# Altium schematic sheet Voltage Measurement Stage.SchDoc: Voltage Measurement Stage
size A3; Date: 28.08.2010; ApprovedBy: V.Gyurov; CheckedBy: V.Gyurov; Author: V.Gyurov; CompanyName: V.Gyurov; DrawnBy: V.Gyurov; Engineer: V.Gyurov; DocumentNumber: 3; Revision: 00; SheetNumber: 3; SheetTotal: 7; VersionControl_RevNumber: V1.00 R.00; CurrentDate: 28.08.2010; DocumentName: Voltage Measurement Stage; ModifiedDate: 28.08.2010
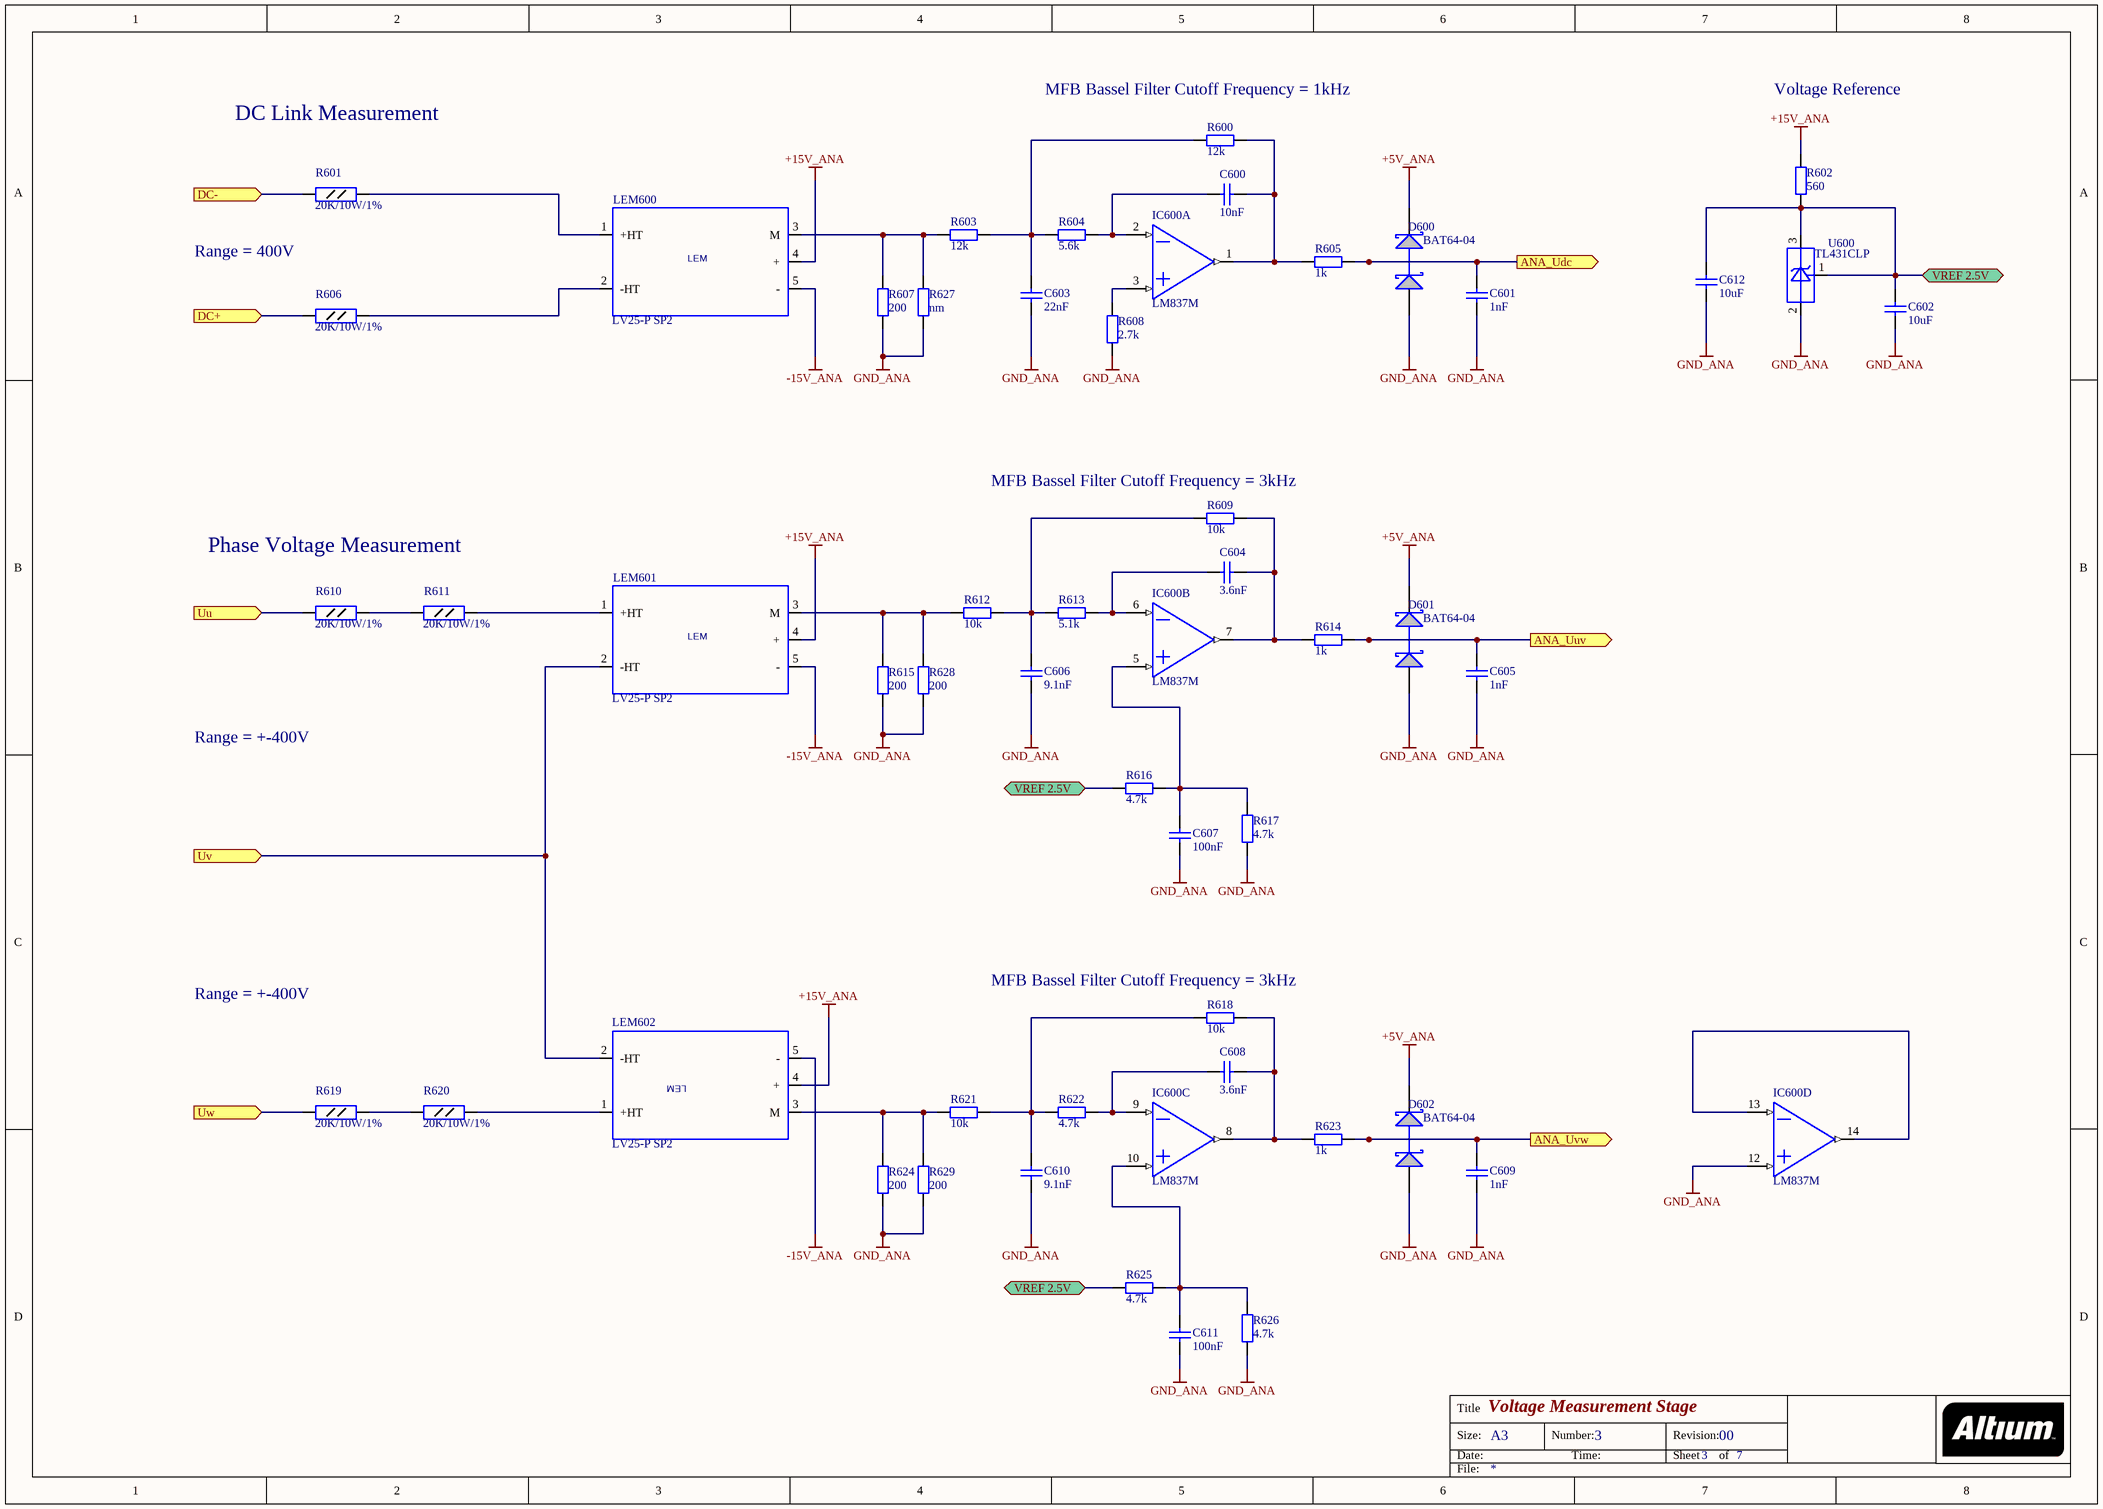
[diagram p0: Voltage Measurement Stage.SchDoc]

## Parts
C600  value 10nF  [1206_REFLOW]  (hidden comment: Cap 1206)
C601  value 1nF  [1206_REFLOW]  (hidden comment: Cap 1206)
C602  value 10uF  [1206_REFLOW]  (hidden comment: Cap 1206)
C603  value 22nF  [1206_REFLOW]  (hidden comment: Cap 1206)
C604  value 3.6nF  [1206_REFLOW]  (hidden comment: Cap 1206)
C605  value 1nF  [1206_REFLOW]  (hidden comment: Cap 1206)
C606  value 9.1nF  [1206_REFLOW]  (hidden comment: Cap 1206)
C607  value 100nF  [1206_REFLOW]  (hidden comment: Cap 1206)
C608  value 3.6nF  [1206_REFLOW]  (hidden comment: Cap 1206)
C609  value 1nF  [1206_REFLOW]  (hidden comment: Cap 1206)
C610  value 9.1nF  [1206_REFLOW]  (hidden comment: Cap 1206)
C611  value 100nF  [1206_REFLOW]  (hidden comment: Cap 1206)
C612  value 10uF  [1206_REFLOW]  (hidden comment: Cap 1206)
D600  BAT64-04  [SOT23_HIS_Primary]
D601  BAT64-04  [SOT23_HIS_Primary]
D602  BAT64-04  [SOT23_HIS_Primary]
IC600  value LM837M  [SO14]  (hidden comment: LM837)  (parts A,B,C,D of 4)
LEM600  value LV25-P SP2  [LV25]  (hidden comment: LEM)
LEM601  value LV25-P SP2  [LV25]  (hidden comment: LEM)
LEM602  value LV25-P SP2  [LV25]  (hidden comment: LEM)
R600  value 12k  [1206_REFLOW]  (hidden comment: RES)
R601  value 20K/10W/1%  [RES 10W]  (hidden comment: RES 10W)
R602  value 560  [1206_REFLOW]  (hidden comment: RES)
R603  value 12k  [1206_REFLOW]  (hidden comment: RES)
R604  value 5.6k  [1206_REFLOW]  (hidden comment: RES)
R605  value 1k  [1206_REFLOW]  (hidden comment: RES)
R606  value 20K/10W/1%  [RES 10W]  (hidden comment: RES 10W)
R607  value 200  [1206_REFLOW]  (hidden comment: RES)
R608  value 2.7k  [1206_REFLOW]  (hidden comment: RES)
R609  value 10k  [1206_REFLOW]  (hidden comment: RES)
R610  value 20K/10W/1%  [RES 10W]  (hidden comment: RES 10W)
R611  value 20K/10W/1%  [RES 10W]  (hidden comment: RES 10W)
R612  value 10k  [1206_REFLOW]  (hidden comment: RES)
R613  value 5.1k  [1206_REFLOW]  (hidden comment: RES)
R614  value 1k  [1206_REFLOW]  (hidden comment: RES)
R615  value 200  [1206_REFLOW]  (hidden comment: RES)
R616  value 4.7k  [1206_REFLOW]  (hidden comment: RES)
R617  value 4.7k  [1206_REFLOW]  (hidden comment: RES)
R618  value 10k  [1206_REFLOW]  (hidden comment: RES)
R619  value 20K/10W/1%  [RES 10W]  (hidden comment: RES 10W)
R620  value 20K/10W/1%  [RES 10W]  (hidden comment: RES 10W)
R621  value 10k  [1206_REFLOW]  (hidden comment: RES)
R622  value 4.7k  [1206_REFLOW]  (hidden comment: RES)
R623  value 1k  [1206_REFLOW]  (hidden comment: RES)
R624  value 200  [1206_REFLOW]  (hidden comment: RES)
R625  value 4.7k  [1206_REFLOW]  (hidden comment: RES)
R626  value 4.7k  [1206_REFLOW]  (hidden comment: RES)
R627  value nm  [1206_REFLOW]  (hidden comment: RES)
R628  value 200  [1206_REFLOW]  (hidden comment: RES)
R629  value 200  [1206_REFLOW]  (hidden comment: RES)
U600  TL431CLP  [TO-92 - TL431]

## Ports
ANA_Udc (out), ANA_Uuv (out), ANA_Uvw (out), DC+ (in), DC- (in), Uu (in), Uv (in), Uw (in), VREF 2.5V (bidir)

## Nets
+5V_ANA: D600.2(K) D601.2(K) D602.2(K)
+15V_ANA: IC600.4(VCC) LEM600.4(+) LEM601.4(+) LEM602.4(+) R602.2
-15V_ANA: IC600.11(VEE) LEM600.5(-) LEM601.5(-) LEM602.5(-)
GND_ANA: C601.1 C602.1 C603.1 C605.1 C606.1 C607.1 C609.1 C610.1 C611.1 C612.1 D600.1(A) D601.1(A) D602.1(A) IC600.12(+IN4) R607.2 R608.2 R615.2 R617.1 R624.2 R626.1 R627.2 R628.2 R629.2 U600.2(ANODE)
ANA_Udc: C601.2 D600.3(C) R605.2 ; port ANA_Udc
ANA_Uuv: C605.2 D601.3(C) R614.2 ; port ANA_Uuv
ANA_Uvw: C609.2 D602.3(C) R623.2 ; port ANA_Uvw
DC+: R606.2 ; port DC+
DC-: R601.2 ; port DC-
Uu: R610.2 ; port Uu
Uv: LEM601.2(-HT) LEM602.2(-HT) ; port Uv
Uw: R619.2 ; port Uw
VREF 2.5V: C602.2 C612.2 R602.1 R616.1 R625.1 U600.1(REF) U600.3(CATHODE) ; port VREF 2.5V
NetC600_1: C600.1 IC600.2(-IN1) R604.2
NetC600_2: C600.2 IC600.1(OUT1) R600.2 R605.1
NetC603_2: C603.2 R600.1 R603.2 R604.1
NetC604_1: C604.1 IC600.6(-IN2) R613.2
NetC604_2: C604.2 IC600.7(OUT2) R609.2 R614.1
NetC606_2: C606.2 R609.1 R612.2 R613.1
NetC607_2: C607.2 IC600.5(+IN2) R616.2 R617.2
NetC608_1: C608.1 IC600.9(-IN3) R622.2
NetC608_2: C608.2 IC600.8(OUT3) R618.2 R623.1
NetC610_2: C610.2 R618.1 R621.2 R622.1
NetC611_2: C611.2 IC600.10(+IN3) R625.2 R626.2
NetIC600_3: IC600.3(+IN1) R608.1
NetIC600_13: IC600.13(-IN4) IC600.14(OUT4)
NetLEM600_1: LEM600.1(+HT) R601.1
NetLEM600_2: LEM600.2(-HT) R606.1
NetLEM600_3: LEM600.3(M) R603.1 R607.1 R627.1
NetLEM601_1: LEM601.1(+HT) R611.1
NetLEM601_3: LEM601.3(M) R612.1 R615.1 R628.1
NetLEM602_1: LEM602.1(+HT) R620.1
NetLEM602_3: LEM602.3(M) R621.1 R624.1 R629.1
NetR610_1: R610.1 R611.2
NetR619_1: R619.1 R620.2

## Notes on the sheet
- (near R600) MFB Bassel Filter Cutoff Frequency = 1kHz
- Voltage Reference
- DC Link Measurement
- Range = 400V
- (near R609) MFB Bassel Filter Cutoff Frequency = 3kHz
- Phase Voltage Measurement
- Range = +-400V
- (near R618) MFB Bassel Filter Cutoff Frequency = 3kHz
- Title
- Size:
- Date:
- A3
- Number:
- Time:
- Revision:
- Sheet
- of
- File:

## Library data of the parts
D600-D602 = BAT64-04: Silicon Schottky Diodes; Manufacturer: INF; ComponentLink1DescBC: Manufacturer Link; Group: Discrete; Subgroup: Diode; Published: 21-Mar-2003; DatasheetDocument: Oct-1999; PackageDocument: Sep-2001; PackageReference: SOT-23; Publisher: Altium Limited; ComponentLink1URL: http://www.infineon.com/; Value: BAT64-04
IC600 = LM837: Manufacturer: National Semiconductor; Description: Quad Low Noise OpAmp
LEM600-LEM602 = LEM: LV25-P
R600 R602-R605 R607-R609 R612-R618 R621-R629 = RES 1
U600 = TL431CLP: Manufacturer 1: Texas Instruments; PN: 01010112-0041-0000; Group: Power-management ICs; Detail: Adjustable Shunt Regulator; Order Code 1: TL431CLP MBR; OriginalName: LM336BZ; Description: 2.5V Voltage Reference; ComponentField7: Published 24-Aug-2001; Case: TO-92; Mfr 1 PN: TL431CLP; CreateDate: 06/06/2008 17:02:07; ModifyDate: 02/26/2009 17:21:37; Supplier 1: Comet; Price 1: 0.08 ˆ; Value: TL431CLP